# EasyEDA Pro project ProProject_开关电源实验平台_2024-07-17.epro, board PCB1
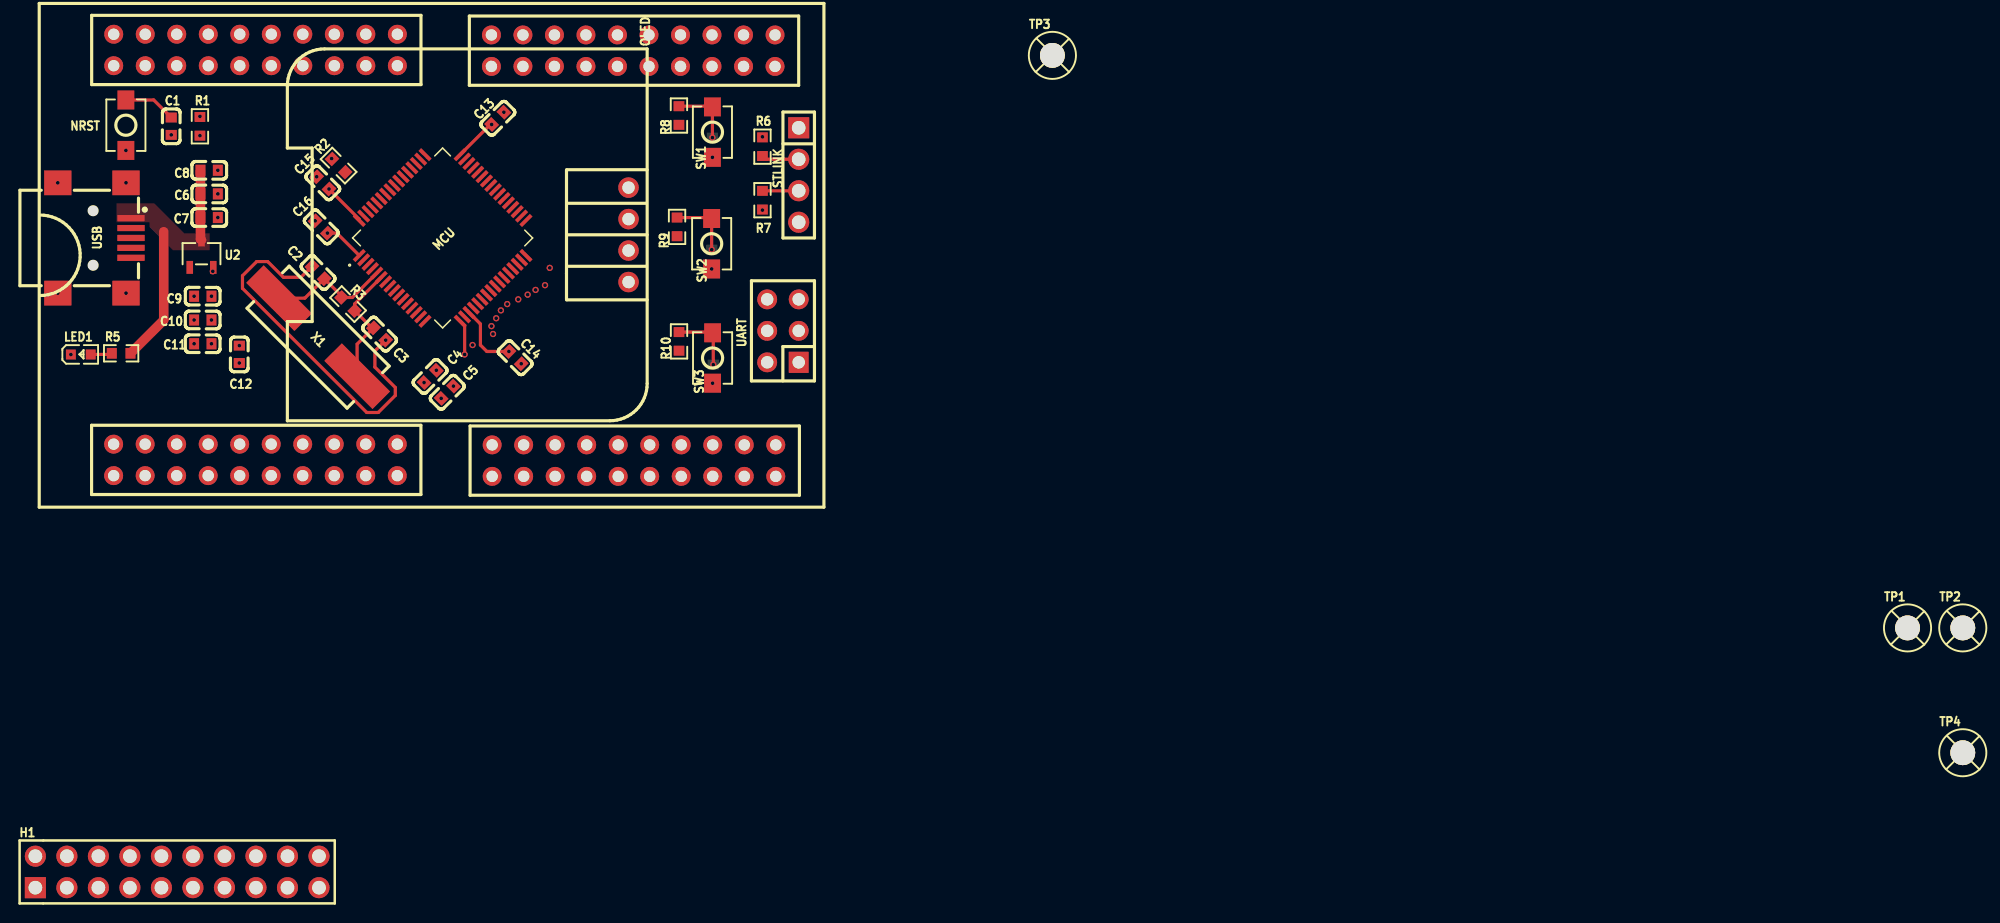
[diagram p2: board, top side]
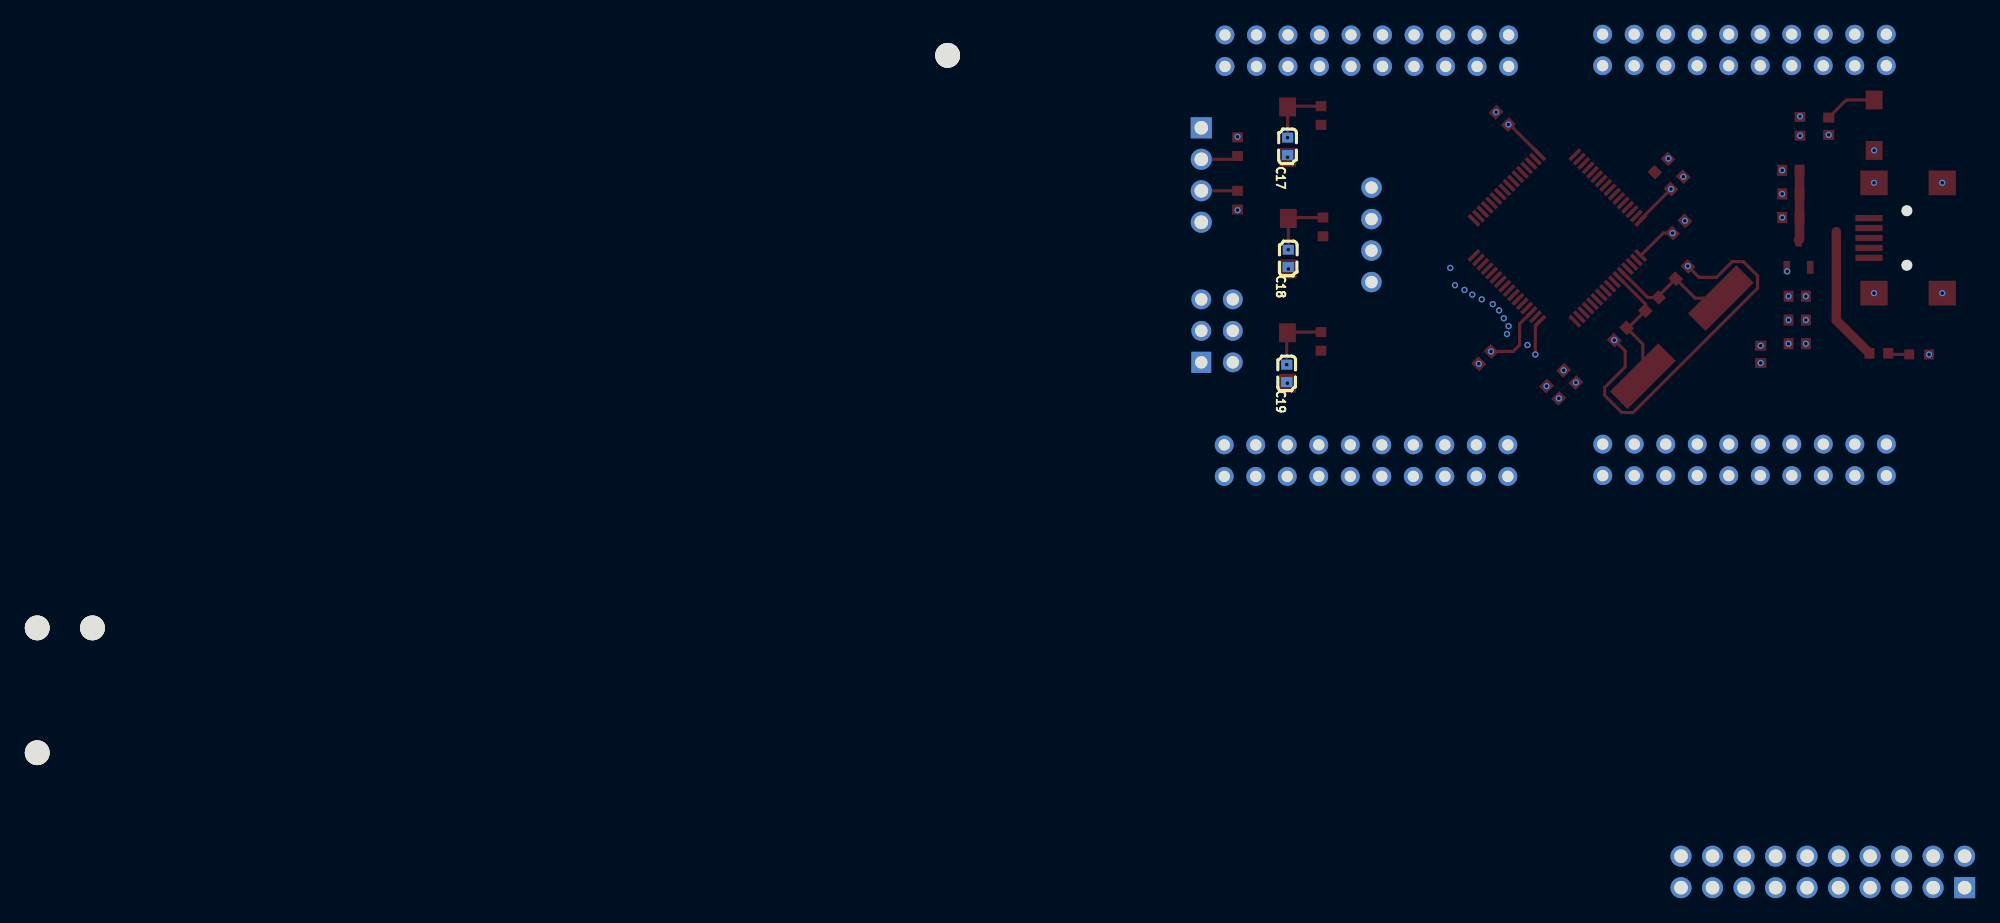
[diagram p3: board, bottom side, seen from below]

Outline 0.89 x 5.29 mm; copper layers: Top Layer, 3V3, GND2, Bottom Layer. Coordinates in mm from the lower left corner of the outline.
Stack: Top Layer 0.035mm 外层铜厚1oz / Dielectric1 0.2104mm 7628 RC49% 8.6mil / 3V3 0.035mm - / Dielectric2 1.065mm 1.1mm H/HOZ 含铜 / GND2 0.035mm - / Dielectric3 0.2104mm 7628 RC49% 8.6mil / Bottom Layer 0.035mm 外层铜厚1oz

## Design rules (mm)
template: 自定义配置
spacing copperThickness1oz (default): track to track 0.102, other pairs 0.152 to 0.3
spacing copperThickness2oz: track to track 0.203, other pairs 0.152 to 0.3
track width copperThickness1oz (default): min 0.127, default 0.254, max 2.54
track width copperThickness2oz: min 0.203, default 0.254, max 2.54
differential pair differentialPair (default): width min 0.127, default 0.254, max 2.54; gap min 0.152, default 0.152
via viaSize (default): diameter min 0.5, default 0.508, max 10; hole min 0.3, default 0.305, max 6.3

## Placement (name value [footprint] x y rotation side)
C1  100nF  [C0603]  6.74 11.66 90 top
C2  20pF  [C0603]  18.58 -0.15 315 top
C3  20pF  [C0603]  23.53 -5.1 135 top
C4  100nF  [C0603]  27.61 -8.52 45 top
C5  100nF  [C0603]  28.99 -9.8 45 top
C6  100nF  [C0603]  9.8 6.2 180 top
C7  100uF  [C0603]  9.8 4.3 180 top
C8  100uF  [C0603]  9.8 8.11 180 top
C9  100nF  [C0603]  9.28 -2.05 0 top
C10  100uF  [C0603]  9.28 -3.97 0 top
C11  100uF  [C0603]  9.28 -5.89 0 top
C12  4.7uF  [C0603]  12.23 -6.74 90 top
C13  100nF  [C0603]  33.06 12.3 225 top
C14  100nF  [C0603]  34.46 -7.01 135 top
C15  100nF  [C0603]  18.96 7.09 315 top
C16  100nF  [C0603]  18.83 3.54 315 top
C17  100nF  [C0603]  50.36 10.04 90 bottom
C18  100nF  [C0603]  50.3 1 90 bottom
C19  100nF  [C0603]  50.43 -8.28 90 bottom
H1  -  [HDR-TH_20P-P2.54-V-M-R2-C10-S2.54]  7.22 -48.5 0 top
LED1  -  [LED_0603]  -0.49 -6.75 0 top
MCU  STM32F334R8T6  [LQFP64-10x10mm]  28.61 2.65 45 top
NRST  -  [Key_SMD_3x4x2]  3.09 11.74 90 top
OLED  -  [0.96OLED_4P]  43.6 2.9 270 top
R1  10K  [R0603]  9.06 11.66 270 top
R2  10K  [R0603]  20.23 8.49 315 top
R3  10M  [R0603]  20.99 -2.69 315 top
R5  1K  [R0603]  2.71 -6.66 180 top
R6  10K  [R0603]  54.39 10.01 90 top
R7  10K  [R0603]  54.39 5.69 90 top
R8  10K  [R0603]  47.66 12.53 270 top
R9  10K  [R0603]  47.51 3.54 270 top
R10  10K  [R0603]  47.67 -5.7 270 top
STLINK  -  [HDR-TH_4P-P2.54-V-M]  57.32 7.73 270 top
SW1  -  [Key_SMD_3x4x2]  50.36 11.19 90 top
SW2  -  [Key_SMD_3x4x2]  50.3 2.18 90 top
SW3  -  [Key_SMD_3x4x2]  50.37 -7.04 90 top
TP1  -  [M2螺丝]  146.69 -28.81 0 top
TP2  -  [M2螺丝]  151.14 -28.81 0 top
TP3  -  [M2螺丝]  77.76 17.38 0 top
TP4  -  [M2螺丝]  151.14 -38.88 0 top
U1  -  [power转接板Mini]  28.74 1.25 0 top
U2  XC6206P332MR  [SOT-23-3_L3.0-W1.7-P0.95-LS2.9-BR]  9.18 1.38 270 top
UART  -  [HDR-TH_6P-P2.54-V-F-R2-C3-S2.54]  56.05 -4.85 90 top
USB  -  [USB_MINI-5P]  0.55 2.65 270 top
X1  8MHz  [CRYSTAL-SMD_L11.5-W4.8-LS12.7]  18.58 -5.35 135 top

## Footprints (pads in the part's own frame, mm; a bottom-side part is the same pattern mirrored in y, then rotated)
0.96OLED_4P
  round 1.65 hole 1: 1(-3.81,-0.002) 2(-1.27,0.002) 3(1.27,0.002) 4(3.81,0.002)
C0603
  rect 0.8x0.9 smd: 1(-0.7,0) 2(0.7,0)
CRYSTAL-SMD_L11.5-W4.8-LS12.7
  rect 5.5x2 smd: 1(-4.45,0) 2(4.45,0)
HDR-TH_4P-P2.54-V-M
  rect 1.7x1.7 hole 1.1: 1(-3.81,0)
  round 1.7 hole 1.1: 2(-1.27,0) 3(1.27,0) 4(3.81,0)
HDR-TH_6P-P2.54-V-F-R2-C3-S2.54
  rect 1.7x1.6 hole 1: 1(-2.54,-1.27)
  round 1.6 hole 1: 2(-2.54,1.27) 3(0,-1.27) 4(0,1.27) 5(2.54,-1.27) 6(2.54,1.27)
HDR-TH_20P-P2.54-V-M-R2-C10-S2.54
  rect 1.7x1.7 hole 1.1: 1(-11.43,-1.27)
  round 1.7 hole 1.1: 2(-11.43,1.27) 3(-8.89,-1.27) 4(-8.89,1.27) 5(-6.35,-1.27) 6(-6.35,1.27) 7(-3.81,-1.27) 8(-3.81,1.27) 9(-1.27,-1.27) 10(-1.27,1.27) 11(1.27,-1.27) 12(1.27,1.27) 13(3.81,-1.27) 14(3.81,1.27) 15(6.35,-1.27) 16(6.35,1.27) 17(8.89,-1.27) 18(8.89,1.27) 19(11.43,-1.27) 20(11.43,1.27)
Key_SMD_3x4x2
  rect 1.53x1.36 smd: 1(-2.035,0) 2(2.035,0)
LED_0603
  rect 0.8x0.8 smd: 1(-0.851,-0.01) 2(0.75,-0.005)
LQFP64-10x10mm
  rect 1.194x0.305 smd: 1(-5.75,3.75) 2(-5.75,3.25) 3(-5.75,2.75) 4(-5.75,2.25) 5(-5.75,1.75) 6(-5.75,1.25) 7(-5.75,0.75) 8(-5.75,0.25) 9(-5.75,-0.25) 10(-5.75,-0.75) 11(-5.75,-1.25) 12(-5.75,-1.75) 13(-5.75,-2.25) 14(-5.75,-2.75) 15(-5.75,-3.25) 16(-5.75,-3.75) 33(5.75,-3.75) 34(5.75,-3.25) 35(5.75,-2.75) 36(5.75,-2.25) 37(5.75,-1.75) 38(5.75,-1.25) 39(5.75,-0.75) 40(5.75,-0.25) 41(5.75,0.25) 42(5.75,0.75) 43(5.75,1.25) 44(5.75,1.75) 45(5.75,2.25) 46(5.75,2.75) 47(5.75,3.25) 48(5.75,3.75)
  rect 0.305x1.194 smd: 17(-3.75,-5.75) 18(-3.25,-5.75) 19(-2.75,-5.75) 20(-2.25,-5.75) 21(-1.75,-5.75) 22(-1.25,-5.75) 23(-0.75,-5.75) 24(-0.25,-5.75) 25(0.25,-5.75) 26(0.75,-5.75) 27(1.25,-5.75) 28(1.75,-5.75) 29(2.25,-5.75) 30(2.75,-5.75) 31(3.25,-5.75) 32(3.75,-5.75) 49(3.75,5.75) 50(3.25,5.75) 51(2.75,5.75) 52(2.25,5.75) 53(1.75,5.75) 54(1.25,5.75) 55(0.75,5.75) 56(0.25,5.75) 57(-0.25,5.75) 58(-0.75,5.75) 59(-1.25,5.75) 60(-1.75,5.75) 61(-2.25,5.75) 62(-2.75,5.75) 63(-3.25,5.75) 64(-3.75,5.75)
M2螺丝
  round 2 hole 2: 1(0,0)
power转接板Mini
  round 1.524 hole 0.914: 1(-26.634,15.294) 2(-24.093,15.294) 3(-21.553,15.294) 4(-19.014,15.294) 5(-16.474,15.294) 6(-13.934,15.294) 7(-11.393,15.294) 8(-8.854,15.294) 9(-6.314,15.294) 10(-3.773,15.294) 11(-26.634,17.834) 12(-24.093,17.834) 13(-21.553,17.834) 14(-19.014,17.834) 15(-16.474,17.834) 16(-13.934,17.834) 17(-11.393,17.834) 18(-8.854,17.834) 19(-6.314,17.834) 20(-3.773,17.834) 21(3.808,15.238) 22(6.348,15.238) 23(8.887,15.238) 24(11.428,15.238) 25(13.967,15.238) 26(16.508,15.238) 27(19.047,15.238) 28(21.587,15.238) 29(24.128,15.238) 30(26.668,15.238) 31(3.808,17.778) 32(6.348,17.778) 33(8.887,17.778) 34(11.428,17.778) 35(13.967,17.778) 36(16.508,17.778) 37(19.047,17.778) 38(21.587,17.778) 39(24.128,17.778) 40(26.668,17.778) 41(-26.64,-15.238) 42(-24.101,-15.238) 43(-21.561,-15.238) 44(-19.02,-15.238) 45(-16.48,-15.238) 46(-13.941,-15.238) 47(-11.4,-15.238) 48(-8.861,-15.238) 49(-6.321,-15.238) 50(-3.78,-15.238) 51(-26.64,-17.778) 52(-24.101,-17.778) 53(-21.561,-17.778) 54(-19.02,-17.778) 55(-16.48,-17.778) 56(-13.941,-17.778) 57(-11.4,-17.778) 58(-8.861,-17.778) 59(-6.321,-17.778) 60(-3.78,-17.778) 61(3.867,-15.296) 62(6.407,-15.296) 63(8.947,-15.296) 64(11.487,-15.296) 65(14.027,-15.296) 66(16.567,-15.296) 67(19.107,-15.296) 68(21.647,-15.296) 69(24.187,-15.296) 70(26.727,-15.296) 71(3.867,-17.836) 72(6.407,-17.836) 73(8.947,-17.836) 74(11.487,-17.836) 75(14.027,-17.836) 76(16.567,-17.836) 77(19.107,-17.836) 78(21.647,-17.836) 79(24.187,-17.836) 80(26.727,-17.836)
R0603
  rect 0.806x0.864 smd: 1(-0.753,0) 2(0.753,0)
SOT-23-3_L3.0-W1.7-P0.95-LS2.9-BR
  rect 1.038x0.532 smd: 1(1.101,-0.95) 2(1.101,0.95) 3(-1.101,0)
USB_MINI-5P
  rect 0.5x2.2 smd: 1(-1.6,2.95) 2(-0.8,2.95) 3(0,2.95) 4(0.8,2.95) 5(1.6,2.95)
  rect 2x2.2 smd: 6(-4.45,2.55) 7(4.45,2.55) 8(4.45,-2.95) 9(-4.45,-2.95)

## Nets
3V3: C4.2 C5.2 C9.2 C10.2 C11.2 C12.2 C13.2 C14.2 C15.2 C16.2 MCU.1 MCU.13 MCU.19 MCU.32 MCU.48 MCU.64 OLED.2 R1.2 R6.2 R7.1 STLINK.1 U1.1 U1.41 U2.2 UART.2 UART.4
+5V: C6.2 C7.2 C8.2 R5.1 U1.11 U1.51 U2.3 USB.1
GND: C1.1 C2.1 C3.1 C4.1 C5.1 C6.1 C7.1 C8.1 C9.1 C10.1 C11.1 C12.1 C13.1 C14.1 C15.1 C16.1 C17.1 C18.1 C19.1 LED1.1 MCU.12 MCU.18 MCU.31 MCU.47 MCU.63 NRST.1 OLED.1 R2.1 STLINK.4 SW1.1 SW2.1 SW3.1 U1.12 U1.31 U1.52 U1.71 U2.1 UART.5 UART.6 USB.5 USB.6 USB.7 USB.8 USB.9
ADC1: MCU.14 U1.53
ADC2: MCU.15 U1.54
ADC3: MCU.16 U1.55
ADC4: MCU.17 U1.56
ADC5: MCU.20 U1.57
ADC6: MCU.8 U1.13
ADC7: MCU.9 U1.14
ADC8: MCU.10 U1.15
ADC9: MCU.11 U1.16
ADC10: MCU.24 U1.17
HRTIM_CHA1: MCU.41 U1.61
HRTIM_CHA2: MCU.42 U1.62
HRTIM_CHB1: MCU.43 U1.63
HRTIM_CHB2: MCU.44 U1.64
HRTIM_CHC1: MCU.33 U1.21
HRTIM_CHC2: MCU.34 U1.22
HRTIM_CHD1: MCU.35 U1.23
HRTIM_CHD2: MCU.36 U1.24
I2C1_SCL: MCU.29 OLED.3 U1.49
I2C1_SDA: MCU.30 OLED.4 U1.50
JTCK: MCU.49 R7.2 STLINK.3
JTMS: MCU.46 R6.1 STLINK.2
NRST: C1.2 MCU.7 NRST.2 R1.1
PA5: MCU.21 U1.45
PA6: MCU.22 U1.46
PA7: MCU.23 U1.74
PA12: MCU.45 U1.72
PA15: MCU.50 U1.32
PB0: MCU.26 R8.2 U1.80
PB1: MCU.27 R9.2 U1.79
PB2: MCU.28 R10.2 U1.78
PC5: MCU.25 U1.5
PC6: MCU.37 U1.70
PC7: MCU.38 U1.69
PC8: MCU.39 U1.68
PC9: MCU.40 U1.67
PC10: MCU.51 U1.30
PC11: MCU.52 U1.29
PC12: MCU.53 U1.28
PC13: MCU.2 U1.40
PC14: MCU.4 U1.39
PC15: MCU.3 U1.38
PD2: MCU.54 U1.27
SPI_MISO: MCU.56 U1.36
SPI_MOSI: MCU.57 U1.37
SPI_SCK: MCU.55 U1.7
UART1_RX: MCU.59 U1.3 UART.3
UART1_TX: MCU.58 U1.4 UART.1
UART3_RX: MCU.61 U1.43
UART3_TX: MCU.62 U1.44
$1N3359: MCU.60 R2.2
$1N3600: C2.2 MCU.5 R3.1 X1.2
$1N3606: C3.2 MCU.6 R3.2 X1.1
$1N5228: LED1.2 R5.2
$1N11064: C17.2 R8.1 SW1.2
$1N11256: C18.2 R9.1 SW2.2
$1N11330: C19.2 R10.1 SW3.2

Pads without a net: H1 1 2 3 4 5 6 7 8 9 10 11 12 13 14 15 16 17 18 19 20; TP1 1; TP2 1; TP3 1; TP4 1; U1 2 6 8 9 10 18 19 20 25 26 33 34 35 42 47 48 58 59 60 65 66 73 75 76 77; USB 2 3 4

## Via types
v1: diameter 0.508, hole 0.305, Top Layer to Bottom Layer, 56 vias

## Routing (per net, layer and track width the routed paths; a pad name or vN(x,y) marks a point on that pad's centre or on a via; arc(x,y) is an arc through that point)
3V3: length 15.9
  Top Layer w0.254: MCU.64 21.9,4.16 v1(19.46,6.6) ; MCU.1 20.09,3.04 v1(19.33,3.04) ; MCU.19 31.66,-4.29 31.66,-5.99 32.18,-6.51 v1(33.96,-6.51) ; v1(32.56,11.8) 32.47,11.8 MCU.48
  vias: v1(9.06,10.9) v1(9.98,-2.05) v1(9.98,-3.97) v1(9.98,-5.89) v1(10.09,-0.04) v1(12.23,-6.04) v1(28.11,-8.03) v1(29.49,-9.3) v1(54.39,10.81) v1(54.39,4.89)
+5V: length 16.6
  Top Layer w0.762: 6.13,3.15 6.13,-3.98 R5.1 ; U2.3 9.1,2.56 C7.2 C6.2 C8.2
GND: length 30.5
  Top Layer w0.254: v1(18.1,0.38) 17.19,-0.53 15.79,-0.53 14.52,0.74 13.63,0.74 12.48,-0.4 12.48,-1.42 22.5,-11.43 23.42,-11.43 24.8,-10.05 24.8,-9.42 23.15,-7.77 23.15,-6.47 v1(24.03,-5.6)
  vias: v1(-2.4,7.1) v1(-2.4,-1.8) v1(-1.35,-6.76) v1(3.09,9.71) v1(3.1,7.1) v1(3.1,-1.8) v1(6.74,10.96) v1(8.58,-2.05) v1(8.58,-3.97) v1(8.58,-5.89) v1(10.5,8.11) v1(10.5,6.2) v1(10.5,4.3) v1(12.23,-7.44) v1(18.34,4.03) v1(18.47,7.59) v1(19.67,9.05) v1(27.12,-9.02) v1(28.5,-10.29) v1(31.03,-5.99) v1(33.55,12.79) v1(34.95,-7.5) v1(37.25,0.23) v1(50.36,9.15) v1(50.3,0.15) v1(50.37,-9.07)
ADC4: length 2.8
  Top Layer w0.254: v1(30.39,-6.75) 30.39,-4.44 MCU.17
ADC5:
  vias: v1(32.68,-5.1)
ADC10:
  vias: v1(33.82,-2.69)
JTCK: length 2.9
  Top Layer w0.254: STLINK.3 57.31,6.45 R7.2
JTMS: length 3
  Top Layer w0.254: R6.1 54.66,9 STLINK.2
NRST: length 4.2
  Top Layer w0.254: C1.2 5.33,13.78 NRST.2
  vias: v1(9.06,12.46)
PA5:
  vias: v1(32.55,-4.47)
PA6:
  vias: v1(32.93,-3.83)
PA7:
  vias: v1(33.31,-3.2)
PB0:
  vias: v1(35.47,-1.93)
PB1:
  vias: v1(36.11,-1.54)
PB2:
  vias: v1(36.87,-1.16)
PC5:
  vias: v1(34.71,-2.31)
$1N3600: length 10
  Top Layer w0.254: MCU.5 21.34,-2.16 R3.1 20.46,-2.03 C2.2 17.51,-2.21 X1.2
$1N3606: length 10.1
  Top Layer w0.254: X1.1 21.73,-5.92 23.04,-4.61 22.91,-4.61 R3.2 21.53,-2.67 MCU.6
$1N5228: length 1.7
  Top Layer w0.254: R5.2 1.86,-6.75 LED1.2
$1N11064: length 5.2
  Top Layer w0.254: R8.1 50.3,13.28 SW1.2 v1(50.36,10.74)
$1N11256: length 5.3
  Top Layer w0.254: R9.1 50.22,4.29 SW2.2 50.3,1.71 v1(50.3,1.7)
$1N11330: length 5.3
  Top Layer w0.254: v1(50.43,-7.58) 50.43,-5.06 SW3.2 50.32,-4.94 R10.1

## Copper pours and planes (outline as drawn; the poured copper is in the pictures)
+5V on Top Layer: 2.32,5.44 9.84,5.44 9.84,1.65 2.32,1.65
